# EAGLE design Main (EAGLE 9.6.2)
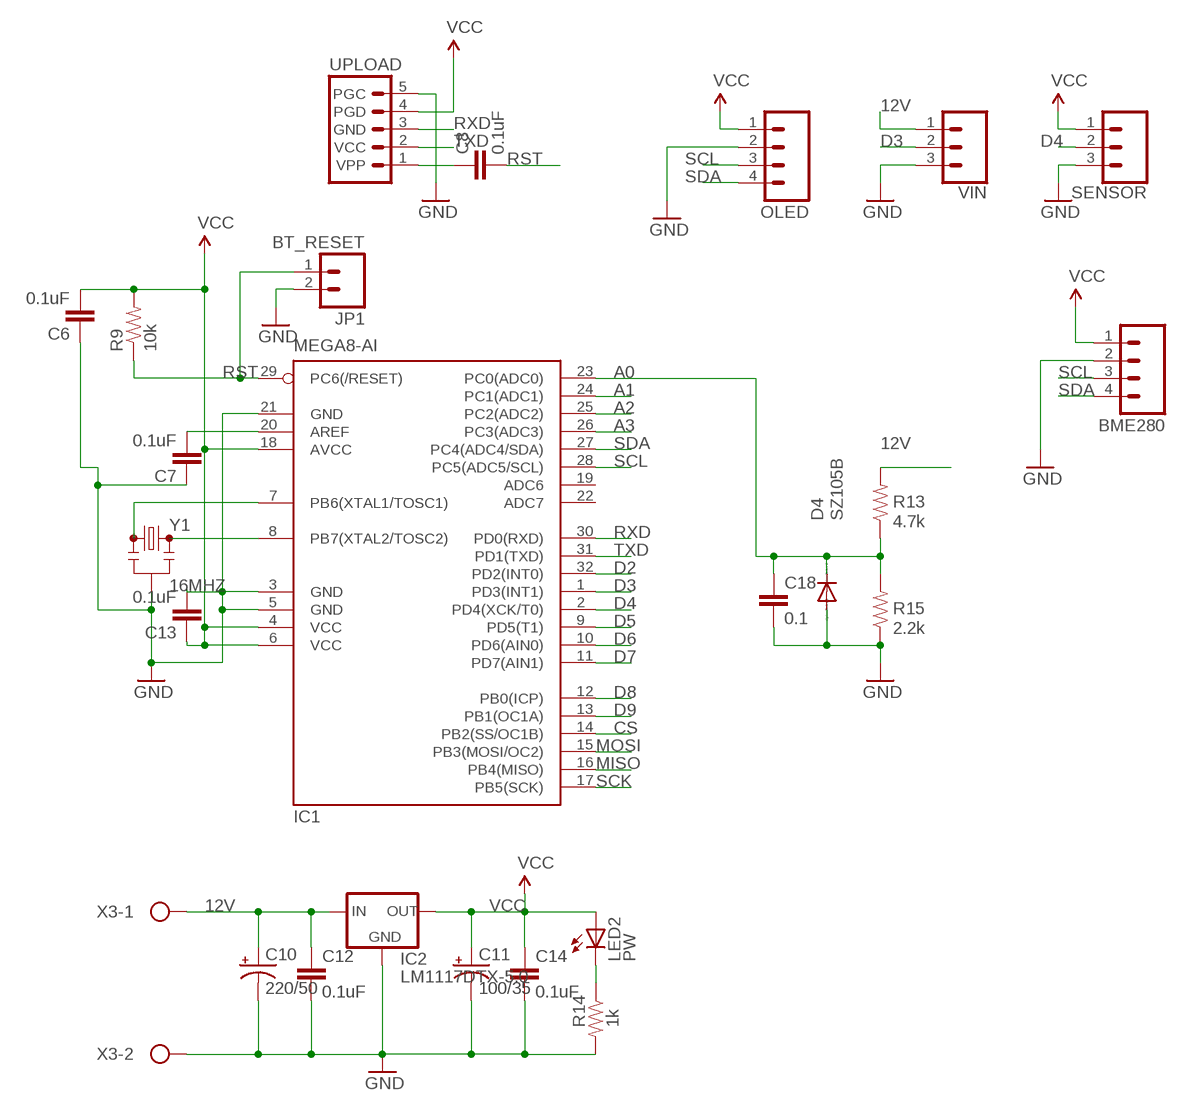
[diagram p0: schematic, sheet 1]

## Parts
BME280  M04PTH  [1X04]
C6  0.1uF  CAP0805  [0805]
C7  0.1uF  CAP0805  [0805]
C8  0.1uF  CAP0805  [0805]
C10  220/50  CPOL-US153CLV-1010  [153CLV-1010]
C11  100/35  CPOL-US153CLV-0605  [153CLV-0605]
C12  0.1uF  CAP0805  [0805]
C13  0.1uF  CAP0805  [0805]
C14  0.1uF  CAP0805  [0805]
C18  0.1  CAP0805  [0805]
D4  SZ105B  DIODE-DO-214AC  [DO-214AC]
IC1  MEGA8-AI  [TQFP32-08]
IC2  LM1117DTX-5.0  LM1117DTX-3.3  [TO252]
JP1  BT_RESET  M02PTH  [1X02]
LED2  PW  LED3MM  [LED3MM]
OLED  M04PTH  [1X04]
R9  10k  RESISTOR0805-RES  [0805]
R13  4.7k  RESISTOR0805-RES  [0805]
R14  1k  RESISTOR0805-RES  [0805]
R15  2.2k  RESISTOR0805-RES  [0805]
SENSOR  CONN_03JST-PTH-VERT  [JST-3-PTH-VERT]
UPLOAD  PIC_ICSP_MINI_5_PIN  [PIC_ICSP_MINI_5_PIN]
VIN  CONN_03JST-PTH-VERT  [JST-3-PTH-VERT]
X3  RELAY1  W237-102  [W237-102]
Y1  16MHZ  RESONATOR16MHZ  [RESONATOR-SMD]

## Nets
12V: C10.+ C12.1 IC2.2(IN) R13.2 VIN.1 X3.1
A0: C18.1 D4.C IC1.23(PC0(ADC0)) R13.1 R15.2
A1: IC1.24(PC1(ADC1))
A2: IC1.25(PC2(ADC2))
A3: IC1.26(PC3(ADC3))
CS: IC1.14(PB2(SS/OC1B))
D2: IC1.32(PD2(INT0))
D3: IC1.1(PD3(INT1)) VIN.2
D4: IC1.2(PD4(XCK/T0)) SENSOR.2
D5: IC1.9(PD5(T1))
D6: IC1.10(PD6(AIN0))
D7: IC1.11(PD7(AIN1))
D8: IC1.12(PB0(ICP))
D9: IC1.13(PB1(OC1A))
GND: BME280.2 C6.1 C7.1 C10.- C11.- C12.2 C13.2 C14.2 C18.2 D4.A IC1.3(GND) IC1.5(GND) IC1.21(GND) IC2.1(GND) JP1.2 OLED.2 R14.2 R15.1 SENSOR.3 UPLOAD.5(PGC) VIN.3 X3.2 Y1.2
MISO: IC1.16(PB4(MISO))
MOSI: IC1.15(PB3(MOSI/OC2))
N$5: IC1.8(PB7(XTAL2/TOSC2)) Y1.3
N$7: IC1.7(PB6(XTAL1/TOSC1)) Y1.1
N$8: C7.2 IC1.20(AREF)
N$9: C8.1 UPLOAD.1(VPP)
N$12: LED2.K(C) R14.1
RST: C8.2 IC1.29(PC6(/RESET)) JP1.1 R9.1
RXD: IC1.30(PD0(RXD)) UPLOAD.3(GND)
SCK: IC1.17(PB5(SCK))
SCL: BME280.3 IC1.28(PC5(ADC5/SCL)) OLED.3
SDA: BME280.4 IC1.27(PC4(ADC4/SDA)) OLED.4
TXD: IC1.31(PD1(TXD)) UPLOAD.2(VCC)
VCC: BME280.1 C6.2 C11.+ C13.1 C14.1 IC1.4(VCC) IC1.6(VCC) IC1.18(AVCC) IC2.TAB(OUT) LED2.A OLED.1 R9.2 SENSOR.1 UPLOAD.4(PGD)
Unconnected: IC1.19(ADC6) IC1.22(ADC7)

## Library data of the parts
BME280 OLED = SparkFun-Connectors:M04: Header 4 Standard 4-pin 0.1" header. Use with straight break away headers (SKU : PRT-00116), right angle break away headers (PRT-00553), swiss pins (PRT-00743), machine pins (PRT-00117), and female headers (PRT-00115). Molex polarized connector foot print use with SKU : PRT-08231 with associated crimp pins and housings. 1MM SMD Version SKU: PRT-10208
C6-C8 C12-C14 C18 = SparkFun-Passives:CAP: Capacitor Standard 0603 ceramic capacitor, and 0.1" leaded capacitor.
C10 C11 = adafruit:CPOL-US: POLARIZED CAPACITOR, American symbol
D4 = diode:DIODE-: DIODE
IC1 = atmel:MEGA8: MICROCONTROLLER 8 Kbytes FLASH, 1 kbytes SRAM, 512 bytes EEPROM, USART, 6-channel 10 bit ADC, 2-channel 8 bit ADC Pin compatible with Atmega48, ATMega88, ATMega168 Source: avr.lbr; MPN: ATMEGA8-16AU; OC_FARNELL: 9171371; OC_NEWARK: 73M8863
IC2 = lm1117:LM1117DTX-*
JP1 = SparkFun:M02: Header 2 Standard 2-pin 0.1" header. Use with straight break away headers (SKU : PRT-00116), right angle break away headers (PRT-00553), swiss pins (PRT-00743), machine pins (PRT-00117), and female headers (PRT-00115). Molex polarized connector foot print use with SKU : PRT-08233 with associated crimp pins and housings.
LED2 = adafruit:LED: LED OSRAM: - CHIPLED LG R971, LG N971, LY N971, LG Q971, LY Q971, LO R971, LY R971 LH N974, LH R974 LS Q976, LO Q976, LY Q976 LO Q996 - Hyper CHIPLED LW Q18S LB Q993, LB Q99A, LB R99A - SideLED LS A670, LO A670, LY A670, LG A670, LP A670 LB A673, LV A673, LT A673, LW A673 LH A674 LY A675 LS A676, LA A676, LO A676, LY A676, LW A676 LS A679, LY A679, LG A679 - Hyper Micro SIDELED® LS Y876, LA Y876, LO Y876, LY Y876 LT Y87S - SmartLED LW L88C, LW L88S LB L89C, LB L89S, LG L890 LS L89K, LO L89K, LY L89K LS L896, LA L896, LO L896, LY L896 - TOPLED LS T670, LO T670, LY T670, LG T670, LP T670 LSG T670, LSP T670, LSY T670, LOP T670, LYG T670 LG T671, LOG T671, LSG T671 LB T673, LV T673, LT T673, LW T673 LH T674 LS T676, LA T676, LO T676, LY T676, LB T676, LH T676, LSB T676, LW T676 LB T67C, LV T67C, LT T67C, LS T67K, LO T67K, LY T67K, LW E67C LS E67B, LA E67B, LO E67B, LY E67B, LB E67C, LV E67C, LT E67C LW T67C LS T679, LY T679, LG T679 LS T770, LO T770, LY T770, LG T770, LP T770 LB T773, LV T773, LT T773, LW T773 LH T774 LS E675, LA E675, LY E675, LS T675 LS T776, LA T776, LO T776, LY T776, LB T776 LHGB T686 LT T68C, LB T68C - Hyper Mini TOPLED® LB M676 - Mini TOPLED Santana® LG M470 LS M47K, LO M47K, LY M47K Source: http://www.osram.convergy.de/
R9 R13-R15 = SparkFun-Resistors:RESISTOR: Resistor Basic schematic elements and footprints for 0603, 1206, and PTH resistors.
SENSOR VIN = SparkFun-Connectors:CONN_03: Multi connection point. Often used as Generic Header-pin footprint for 0.1 inch spaced/style header connections On any of the 0.1 inch spaced packages, you can populate with these: Break Away Headers - Straight <https://www.sparkfun.com/products/116> (PRT-00116) Break Away Male Headers - Right Angle <https://www.sparkfun.com/products/553> (PRT-00553) Female Headers <https://www.sparkfun.com/products/115> (PRT-00115) Break Away Headers - Machine Pin <https://www.sparkfun.com/products/117> (PRT-00117) Break Away Female Headers - Swiss Machine Pin <https://www.sparkfun.com/products/743> (PRT-00743) Stackable Header - 3 Pin (Female, 0.1") <https://www.sparkfun.com/products/13875> (PRT-13875) For SCREWTERMINALS and SPRING TERMINALS visit here: Screw Terimnals on SparkFun.com <https://www.sparkfun.com/search/results?term=Screw+Terminals> (5mm/3.5mm/2.54mm spacing) This device is also useful as a general connection point to wire up your design to another part of your project. Our various solder wires solder well into these plated through hole pads. Hook-Up Wire - Assortment (Stranded, 22 AWG) <https://www.sparkfun.com/products/11375> (PRT-11375) Hook-Up Wire - Assortment (Solid Core, 22 AWG) <https://www.sparkfun.com/products/11367> (PRT-11367) View the entire wire category on our website here <https://www.sparkfun.com/categories/141> Special notes: Molex polarized connector foot print use with SKU : PRT-08232 with associated crimp pins and housings.; PROD_ID: CONN-13230
UPLOAD = SparkFun-Connectors:PIC_ICSP_MINI_5_PIN: PIC-ICSP-Mini Miniature 5-pin connection for temporary programming of PICs. Use this device in your design to save space. Miniature ISCP Programming connector for PICs This 5 pin header contains all the lines necessary for programming most PIC microcontrollers. Use this device in your design to save space. Here is the connector we sell at SparkFun: 5-Pin Mini ICSP Connector <https://www.sparkfun.com/products/11264> (PRT-11264) It is used on these SparkFun products: USB Bit Whacker - 18F2553 Development Board <https://www.sparkfun.com/products/762> (DEV-00762) SparkFun Serial Enabled LCD Backpack <https://www.sparkfun.com/products/258> (LCD-00258) Also, if you need a nice PIC programmer, please check these out: MPLAB PICkit 3 <https://www.sparkfun.com/products/9973> (PGM-09973); PROD_ID: CONN-08314; SF_ID: PRT-11264
X3 = con-wago-500:W237-102: WAGO SCREW CLAMP; MPN: 237-102; OC_FARNELL: unknown; OC_NEWARK: 70K9898
Y1 = SparkFun-FreqCtrl:RESONATOR: Resonator Small SMD resonator. Used, eg, on the Arduino Pro/ Pro Mini boards. 8MHz- XTAL-08895 16MHz- XTAL-08900; PROD_ID: XTAL-08900

## Net classes
1 power: width 0.203 mm

## Board
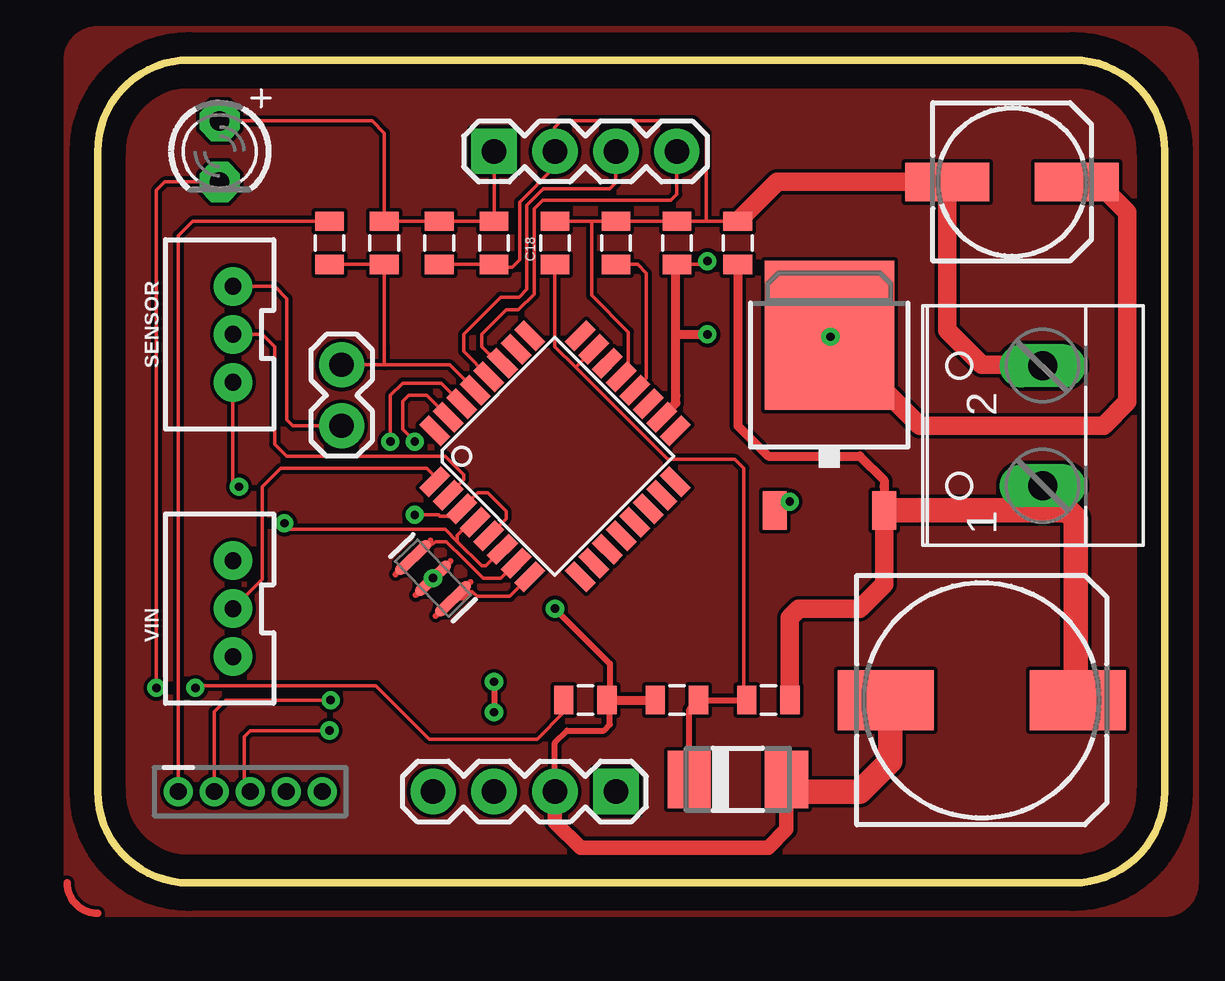
[diagram p1: board, top side]
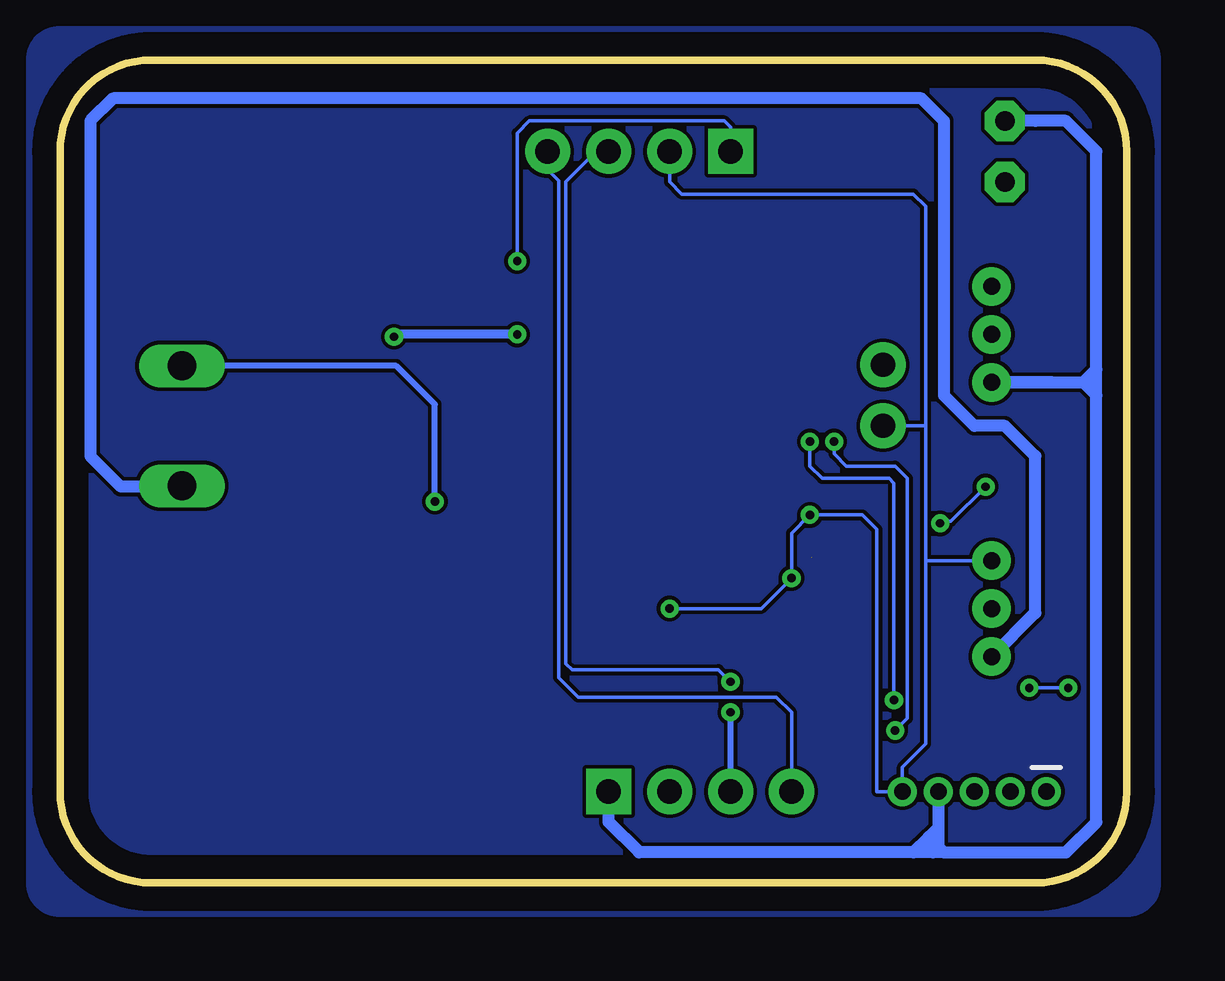
[diagram p2: board, bottom side, seen from below]

Size 44.45 x 34.29 mm. Coordinates in mm from the lower left corner, seen from the top.
Outline: 3.81,34.29 40.64,34.29 arc-90 44.45,30.48 44.45,3.81 arc-90 40.64,0 3.81,0 arc-90 0,3.81 0,30.48 arc-90 3.81,34.29
Copper layers (1*16): Top 0.035mm / dielectric 1.5mm / Bottom 0.035mm
Design rules "default": minimum track width 6mil, minimum drill 0.35mm, track to track 6mil, track to pad 6mil, pad to pad 6mil, via to via 6mil, smd to smd 6mil, copper to edge 40mil, drill to drill 6mil, minimum pad ring 10mil, minimum via ring 8mil, stop-mask expansion 4mil, vias tented up to drill 0mil, thermal gap 10mil

### Footprints (pad centres in the part's own frame; a part is rotated, then mirrored left to right if it is on the bottom)
1X04 = drill 1.016 pad 1.88 square: 1 0,0 | drill 1.016 pad 1.88: 2 2.54,0; 3 5.08,0; 4 7.62,0
0805 = smd 0.8 x 1.2: 1 -0.9,0; 2 0.9,0
153CLV-1010 = smd 4 x 2.5: + 4,0; - -4,0
153CLV-0605 = smd 3.5 x 1.6: + 2.7,0; - -2.7,0
DO-214AC = smd 1.8 x 2.4: A 2.025,0; C -2.025,0
TQFP32-08 = smd 1.27 x 0.559: 1 -4.293,2.8; 2 -4.293,2; 3 -4.293,1.2; 4 -4.293,0.4; 5 -4.293,-0.4; 6 -4.293,-1.2; 7 -4.293,-2; 8 -4.293,-2.8; 17 4.293,-2.8; 18 4.293,-2; 19 4.293,-1.2; 20 4.293,-0.4; 21 4.293,0.4; 22 4.293,1.2; 23 4.293,2; 24 4.293,2.8 | smd 0.559 x 1.27: 9 -2.8,-4.293; 10 -2,-4.293; 11 -1.2,-4.293; 12 -0.4,-4.293; 13 0.4,-4.293; 14 1.2,-4.293; 15 2,-4.293; 16 2.8,-4.293; 25 2.8,4.293; 26 2,4.293; 27 1.2,4.293; 28 0.4,4.293; 29 -0.4,4.293; 30 -1.2,4.293; 31 -2,4.293; 32 -2.8,4.293
TO252 = smd 1 x 1.6: 1 -2.28,-4.8; 2 2.28,-4.8 | smd 5.4 x 6.2: TAB 0,2.5
1X02 = drill 1.016 pad 1.88: 1 0,0; 2 2.54,0
LED3MM = drill 0.813 pad 1.676 octagon: A -1.27,0; K 1.27,0
JST-3-PTH-VERT = drill 0.7 pad 1.6: 1 -2,-0.55; 2 0,-0.55; 3 2,-0.55
PIC_ICSP_MINI_5_PIN = drill 0.7: 1 -3,0; 2 -1.5,0; 3 0,0; 4 1.5,0; 5 3,0
W237-102 = drill 1.194 long: 1 -2.5,-1.27; 2 2.5,-1.27
RESONATOR-SMD = smd 0.45 x 1.905: 1 -1.2,0; 2 0,0; 3 1.2,0

### Placement (x,y rotation side)
BME280  21.59,3.81 180 top
C6  14.22,26.67 90 top
C7  21.59,26.67 270 top
C8  9.65,26.67 270 top
C10  36.83,7.62 0 top
C11  38.1,29.21 0 top
C12  26.67,26.67 90 top
C13  24.13,26.67 90 top
C14  16.51,26.67 270 top
C18  19.05,26.67 90 top
D4  26.67,4.32 0 top
IC1  19.05,17.78 45 top
IC2  30.48,20.32 0 top
JP1  10.16,21.59 270 top
LED2  5.08,30.48 270 top
OLED  16.51,30.48 0 top
R9  11.94,26.67 90 top
R13  27.94,7.62 0 top
R14  20.32,7.62 0 top
R15  24.13,7.62 0 top
SENSOR  5.08,22.86 90 top
UPLOAD  6.35,3.81 0 top
VIN  5.08,11.43 90 top
X3  38.1,19.05 90 top
Y1  13.97,12.7 314 top

### Tracks (layer width: path | path; a pad name or v marks a point on that pad's centre or on a via)
12V
  Top 0.152: 32.66,15.6 IC2.2 | C10.+ 40.74,7.67 40.74,15.14 39.37,16.51 X3.1 39.41,16.51
  Top 0.305: 40.64,15.28 40.74,15.18 40.74,7.67
  Top 0.381: C12.1 26.67,19.05 27.94,17.78 31.75,17.78 32.76,16.77 32.76,16.51 IC2.2
  Top 0.61: 40.64,15.28 40.64,7.62
  Top 0.762: R13.2 28.84,11.06 29.21,11.43 31.75,11.43 32.76,12.44 IC2.2
  Top 1.016: IC2.2 39.37,15.52 | 39.37,15.52 40.4,15.52 40.64,15.28 | C10.+ 40.74,7.71 40.74,15.18 | 39.37,15.52 X3.1
  Bottom 0.508: VIN.1 3.81,11.25 3.81,17.78 5.08,19.05 6.35,19.05 7.62,20.32 7.62,31.75 8.56,32.69 42.24,32.69 43.18,31.75 43.18,17.78 41.91,16.51 39.41,16.51 X3.1
A0
  Top 0.152: 19.1,25.65 C18.1 19.05,22.35 19.92,21.48 | 20.98,22.54 20.81,22.37 IC1.23 19.92,21.48 | 19.92,21.48 23.75,17.65 26.54,17.65 26.92,17.27 26.92,7.74 R13.1
  Top 0.254: D4.C 24.64,7.24 R15.2 R13.1 | 20.75,22.37 20.81,22.37 | 20.53,22.14 20.61,22.23 IC1.23
B
  pour Bottom: 0,-1.27 arc-90 -1.27,0 -1.27,34.29 arc-90 0,35.56 44.45,35.56 arc-90 45.72,34.29 45.72,0 arc-90 44.45,-1.27
D3
  Top 0.152: 5.69,11.48 VIN.2 6.86,12.66 6.86,16.51 7.62,17.27 13.72,17.27 14.04,16.95 IC1.1
D4
  Top 0.152: SENSOR.2 6.86,22.86 7.37,22.35 7.37,18.29 7.87,17.78 14.48,17.78 15.24,17.02 15.24,16.8 IC1.2
GND  (via drill 0.35)
  Top 0.152: 19.1,27.64 C18.2 | 21.54,27.64 C7.1 | 21.69,27.64 C7.1 | 26.57,27.64 C12.2 | 24.13,27.64 C13.2 | C11.- 35.26,29.16 28.25,29.16 26.72,27.64 C12.2 | 27.94,4.93 28.55,4.32 D4.A | 28.25,15.44 IC2.1 | IC1.21 22.11,21.41 22.11,22.95 20.57,24.49 20.57,27.57 | C18.2 20.57,27.57 | 20.57,27.57 C7.1 | C7.1 C13.2 | C13.2 25.4,27.57 | 25.4,27.57 C12.2 | 25.4,27.57 25.35,27.62 25.35,31.24 24.84,31.75 19.3,31.75 19.05,31.5 OLED.2 19.05,29.84 17.58,28.37 17.58,25.96 17.27,25.65 16.63,25.65 C14.2 C6.1 | C18.2 C7.1 | JP1.2 8.13,19.05 7.87,19.3 7.87,24.35 7.37,24.86 SENSOR.3 | IC1.5 17.02,15.18 17.02,15.49 16.26,16.26 15.83,16.26 IC1.3 14.86,15.28 14.25,15.28 14.2,15.34 v13.21,15.34
  Top 0.254: IC2.1 28.57,15.89 v28.83,15.89 | C13.2 24.2,27.64 | R14.2 21.41,7.8 21.59,7.62 | BME280.2 19.05,5.84 19.56,6.35 21.08,6.35 21.34,6.6 21.34,7.5 R14.2 | v19.05,11.43 21.34,9.14 21.34,7.74 R14.2
  Top 0.305: C18.2 19.11,27.64 | 26.57,27.64 26.72,27.64 | 32.92,7.53 C10.-
  Top 0.381: R14.2 21.59,7.62 R15.1
  Top 0.61: 31.75,7.62 C10.- | D4.A 28.7,2.23 27.94,1.47 20.12,1.47 19.05,2.54 BME280.2
  Top 0.762: X3.2 39.33,21.59 36.83,21.59 35.4,23.02 C11.- 28.31,29.21 C12.2
  Top 1.016: D4.A 29.2,3.81 31.75,3.81 33.02,5.08 33.02,7.43 32.92,7.53
  Bottom 0.152: 9.35,3.86 UPLOAD.5 | 10.11,18.95 JP1.2 8.38,19.05 | UPLOAD.5 10.41,3.81 10.41,14.73 11.02,15.34 v13.21,15.34 13.97,14.58 Y1.2 15.24,11.43 v19.05,11.43 | OLED.2 19.05,29.21 18.54,28.7 8.89,28.7 8.38,28.19 8.38,19.05 | UPLOAD.5 9.35,4.83 8.38,5.79 8.38,13.43 | 8.38,13.43 8.38,19.05 | VIN.3 8.38,13.43
  Bottom 0.254: v28.83,15.89 28.83,19.94 30.44,21.55 X3.2
  other vias: 13.97,12.7
N$1
  Top 0.305: 0,-1.27 arc-90 -1.27,0
N$5
  Top 0.152: Y1.3 15.23,11.84 15.41,12.02 | 15.41,12.02 15.54,12.14 | IC1.8 17.17,11.94 15.81,11.94 15.61,12.14 15.54,12.14 | 15.41,12.02 15.42,12.02 15.54,12.14
N$7  (1 unrouted)
  Top 0.152: Y1.1 14.07,14.22 14.53,14.22 15.27,13.49 15.6,13.16 16.05,12.7 16.8,12.7 IC1.7
N$8
  Top 0.152: IC1.20 22.86,21.02 22.86,25.4 22.49,25.77 C7.2
N$9
  Top 0.152: 3.4,3.86 UPLOAD.1 3.35,26.97 3.95,27.57 C8.1
N$12  (via drill 0.35)
  Top 0.152: R14.1 19.42,7.11 18.3,6 13.81,6 11.59,8.23 4.06,8.23 v4.06,8.13 | LED2.K 2.79,29.21 2.44,28.86 v2.44,8.13
  Bottom 0.152: v4.06,8.13 v2.44,8.13
RST
  Top 0.152: 10.26,21.54 JP1.1 11.94,21.59 | C8.2 R9.1 11.94,22.35 11.94,22.04 11.94,21.59 | IC1.29 14.67,21.59 11.94,21.59
RXD  (via drill 0.35)
  Top 0.152: IC1.30 14.3,20.83 12.7,20.83 12.19,20.32 v12.19,18.39 | UPLOAD.3 6.1,4.06 6.1,6.1 6.35,6.35 v9.65,6.35
  Bottom 0.152: v12.19,18.39 12.19,17.88 11.68,17.37 9.65,17.37 9.14,16.86 9.14,6.86 v9.65,6.35
SCL  (via drill 0.35)
  Top 0.152: IC1.28 15.24,22.16 15.24,22.86 16.79,24.41 17.55,24.41 17.88,24.74 17.88,28.25 18.57,28.93 21.34,28.93 21.59,29.18 OLED.3
  Top 0.254: v16.51,8.38 v16.51,7.11
  Bottom 0.152: v16.51,8.38 17.02,8.89 23.11,8.89 23.37,9.14 23.37,29.21 22.1,30.48 OLED.3
  Bottom 0.254: BME280.3 v16.51,7.11
SDA
  Top 0.152: IC1.27 16.69,21.66 16,22.35 16,22.86 17.02,23.88 17.53,23.88 18.19,24.54 18.19,28.09 18.54,28.45 23.88,28.45 24.13,28.7 OLED.4
  Bottom 0.152: BME280.4 13.97,7.11 14.61,7.75 22.86,7.75 23.67,8.56 23.67,29.26 24.13,29.72 OLED.4
T
  pour Top: -1.27,0 -1.27,34.29 arc-90 0,35.56 44.45,35.56 arc-90 45.72,34.29 45.72,0 arc-90 44.45,-1.27 0,-1.27
TXD  (via drill 0.35)
  Top 0.152: v13.21,18.39 12.7,18.89 12.7,20.07 12.95,20.32 13.72,20.32 14.6,19.44 IC1.31 | UPLOAD.2 4.85,7.14 5.33,7.62 v9.7,7.62
  Bottom 0.152: v9.7,7.62 9.7,16.66 9.91,16.86 12.7,16.86 13.21,17.37 v13.21,18.39
VCC  (via drill 0.35)
  Top 0.152: 32.97,20.32 v30.53,22.76 IC2.TAB 30.38,22.91 30.38,23.52 | 24.13,25.81 C13.1 25.26,25.77 v25.4,25.91 | 16.51,30.38 OLED.1 | 16.51,30.53 OLED.1 | OLED.1 C14.1 C6.2 R9.2 11.94,31.24 11.43,31.75 LED2.A | IC1.6 16.18,13.21 16,13.21 14.99,14.22 | 14.99,14.22 14.99,14.48 15.54,15.03 IC1.4 | 14.99,14.22 14.48,14.73 7.78,14.73 v7.78,14.99 | v5.88,16.51 5.63,16.76 SENSOR.1
  Top 0.305: 24.09,20.32 24.09,22.86 24.09,25.77
  Top 0.381: 24.09,22.86 v25.4,22.86 | IC1.18 24.09,19.99 24.09,20.32 24.09,25.77 24.13,25.81
  Top 0.762: IC2.TAB 34.25,19.05 41.91,19.05 42.9,20.04 42.9,27.94 41.63,29.21 C11.+
  Bottom 0.152: 7.98,3.71 UPLOAD.4 | 21.54,3.71 BME280.1 | 5.54,20.78 SENSOR.1 5.54,20.93 | v25.4,25.91 25.4,31.24 24.89,31.75 16.76,31.75 16.51,31.5 OLED.1 | v7.78,14.99 7.7,15.06 7.33,15.06 v5.88,16.51
  Bottom 0.381: v25.4,22.86 30.48,22.86 30.53,22.81 v30.53,22.76
  Bottom 0.508: 3.81,31.75 LED2.A 2.54,31.75 1.27,30.48 1.27,21.4 | 3.08,20.86 SENSOR.1 1.81,20.86 | UPLOAD.4 7.85,2.31 | 8.89,1.27 20.32,1.27 21.59,2.54 BME280.1 | 7.62,1.27 8.08,1.27 | 7.62,1.27 2.54,1.27 1.27,2.54 1.27,20.32 | 1.27,20.32 1.27,21.4 | 1.27,20.32 1.81,20.86 | 1.81,20.86 1.27,21.4 | 7.62,1.27 7.85,1.5 | 7.85,2.31 7.85,1.5 | 7.85,1.5 8.08,1.27 | 8.08,1.27 8.89,1.27 | 8.89,1.27 8.26,1.91 | 8.26,1.91 7.85,2.31 | 8.08,1.27 8.26,1.45 8.26,1.91